# EAGLE schematic LCDSerialBackpack (EAGLE 6.5.0)
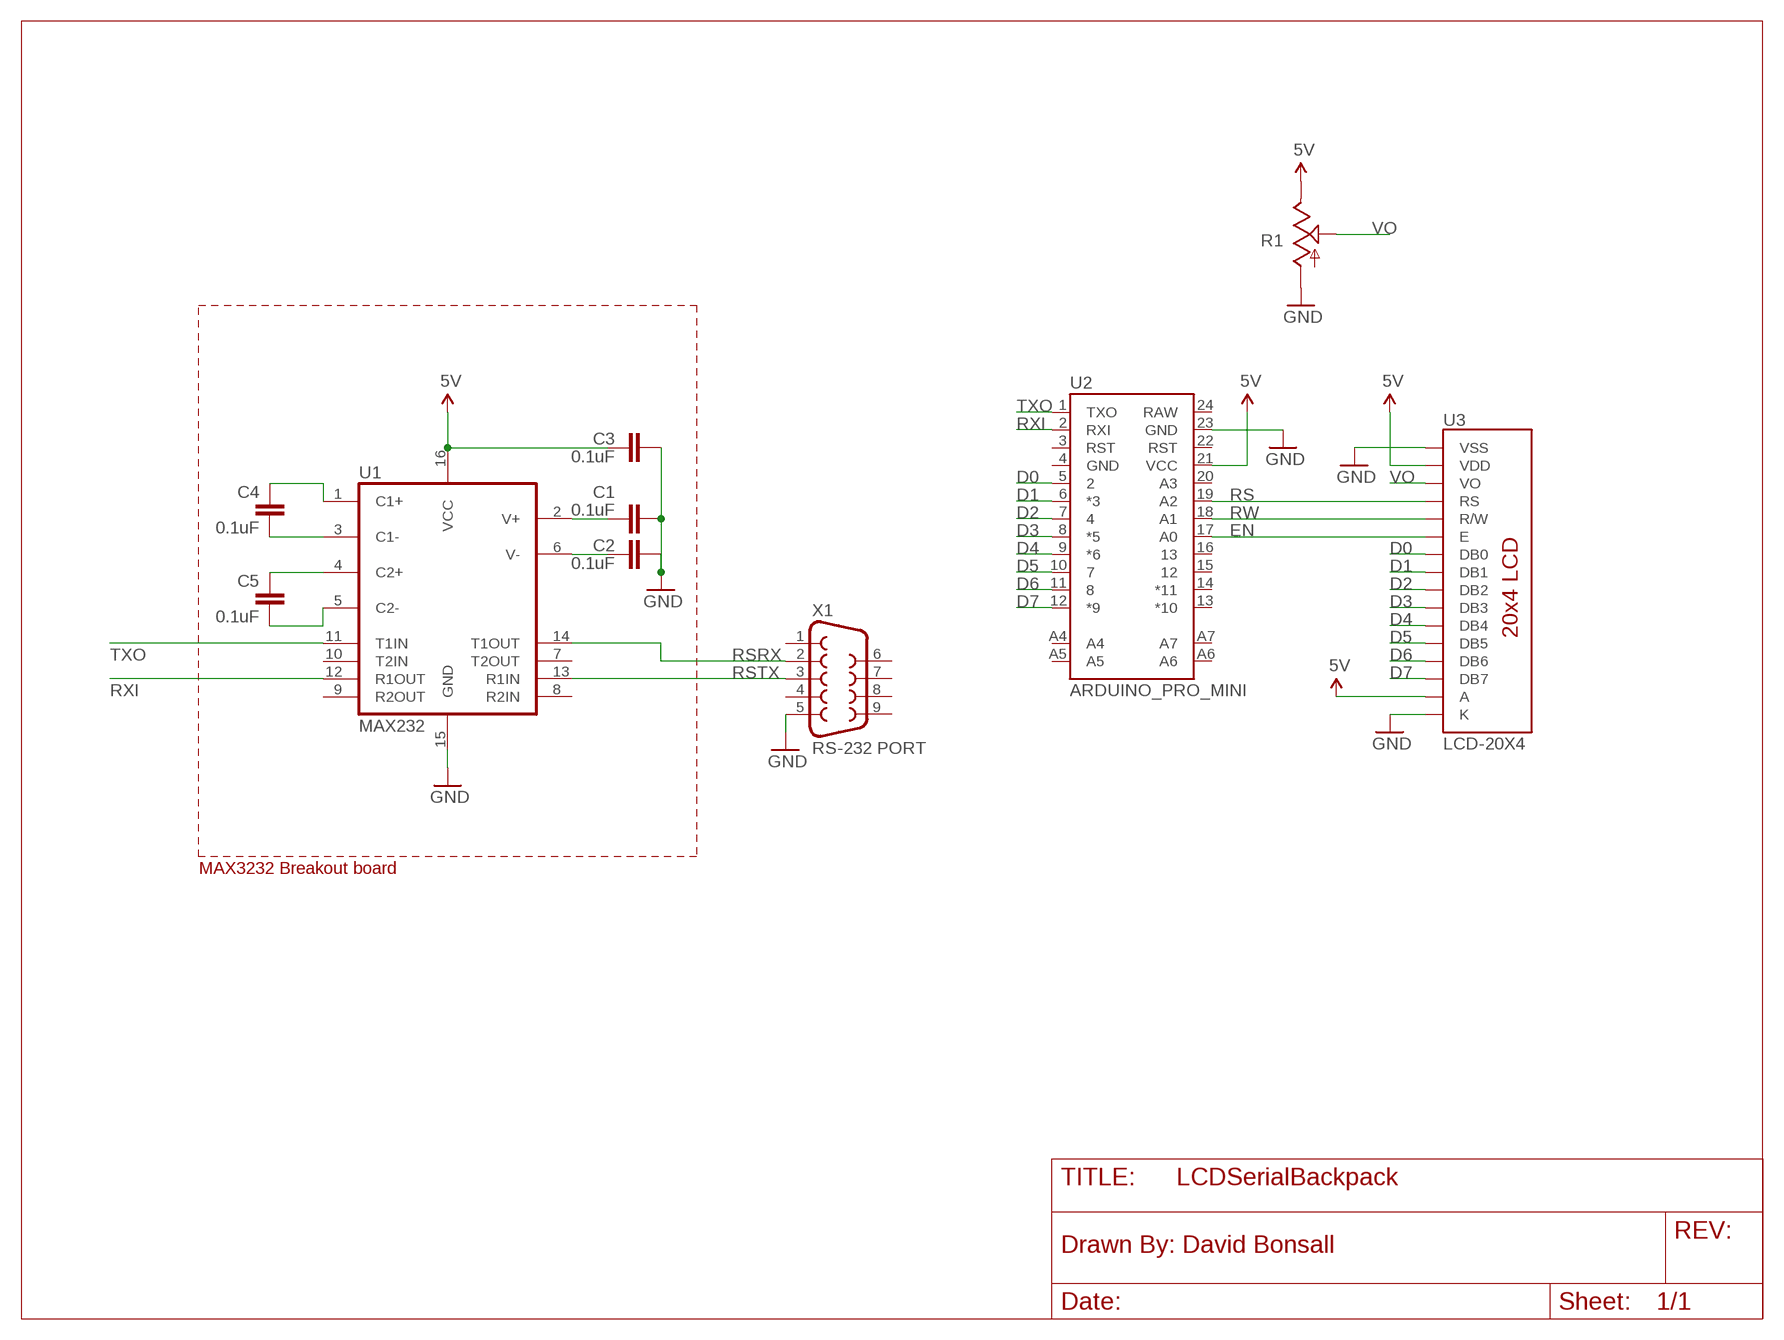
[diagram p0: schematic, sheet 1]

## Parts
C1  0.1uF  .1UF-CER  [0402-CAP]
C2  0.1uF  .1UF-CER  [0402-CAP]
C3  0.1uF  .1UF-CER  [0402-CAP]
C4  0.1uF  .1UF-CER  [0402-CAP]
C5  0.1uF  .1UF-CER  [0402-CAP]
R1  POT100K_3362U  [3362U]
U1  MAX232  MAX232PTH  [DIL16]
U2  ARDUINO_PRO_MINI  [ARDUINO_PRO_MINI]
U3  LCD-20X4  LCD-16X2SILK  [LCD-16X2]
X1  RS-232 PORT  DB9FEMALE  [DB9]

## Nets
5V: C3.1 R1.P$1(E) U1.16(VCC) U2.21(VCC) U3.2(VDD) U3.15(A)
D0: U2.5 U3.7(DB0)
D1: U2.6(*3) U3.8(DB1)
D2: U2.7 U3.9(DB2)
D3: U2.8(*5) U3.10(DB3)
D4: U2.9(*6) U3.11(DB4)
D5: U2.10 U3.12(DB5)
D6: U2.11 U3.13(DB6)
D7: U2.12(*9) U3.14(DB7)
EN: U2.17(A0) U3.6(E)
GND: C1.2 C2.2 C3.2 R1.P$3(A) U1.15(GND) U2.23(GND) U3.1(VSS) U3.16(K) X1.5
N$1: C2.1 U1.6(V-)
N$2: C1.1 U1.2(V+)
N$5: C4.1 U1.3(C1-)
N$6: C4.2 U1.1(C1+)
N$7: C5.2 U1.4(C2+)
N$8: C5.1 U1.5(C2-)
RS: U2.19(A2) U3.4(RS)
RSRX: U1.14(T1OUT) X1.2
RSTX: U1.13(R1IN) X1.3
RW: U2.18(A1) U3.5(R/W)
RXI: U1.12(R1OUT) U2.2(RXI)
TXO: U1.11(T1IN) U2.1(TXO)
VO: R1.P$2(S) U3.3(VO)
Unconnected: U1.7(T2OUT) U1.8(R2IN) U1.9(R2OUT) U1.10(T2IN) U2.3(RST) U2.4(GND) U2.13(*10) U2.14(*11) U2.15 U2.16 U2.20(A3) U2.22(RST) U2.24(RAW) U2.A4 U2.A5 U2.A6 U2.A7 X1.1 X1.4 X1.6 X1.7 X1.8 X1.9

## Notes on the sheet
- MAX3232 Breakout board

## Library data of the parts
C1-C5 = SparkFun-Capacitors:.1UF-CER: .1uF ceramic SMT CAP-00810- 25V +80%/-20% (0603) CAP-08390- 100V 10% (0603) CAP-08604- 25V 5% (0603); PROD_ID: CAP-00810
R1 = SparkFun-Electromechanical:POT
U1 = SparkFun-DigitalIC:MAX232: RS232 Transceiver Very common IC. This is generically called 'MAX232', but works with the 3V equivalent MAX3232 generic ICs. Field tested and mother approved. Spark Fun Electronics SKU : COM-00316 (DIP) and COM-00589 (SMD)
U2 = SparkFun-Boards:ARDUINO_PRO_MINI
U3 = MyLibrary:LCD-16X2: Standard text-only 16x2 parallel input LCD
X1 = SparkFun-Connectors:DB9: DB9 Connector Standard DB9 (D-Sub 9) serial connector. Can be used for CAN bus as well as RS485 and RS232. Footprint production proven. Spark Fun Electronics SKU : PRT-00429